# Altium schematic sheet Overview.SchDoc
size 393 x 281 mm; Organization: iMAR GmbH; Address1: Im Reihersbruch 3; Address2: D-66386 St. Ingbert; Address3: www.imar.de; DocumentNumber: 2; SheetNumber: 2; SheetTotal: 7; Abteilung: Entwicklung
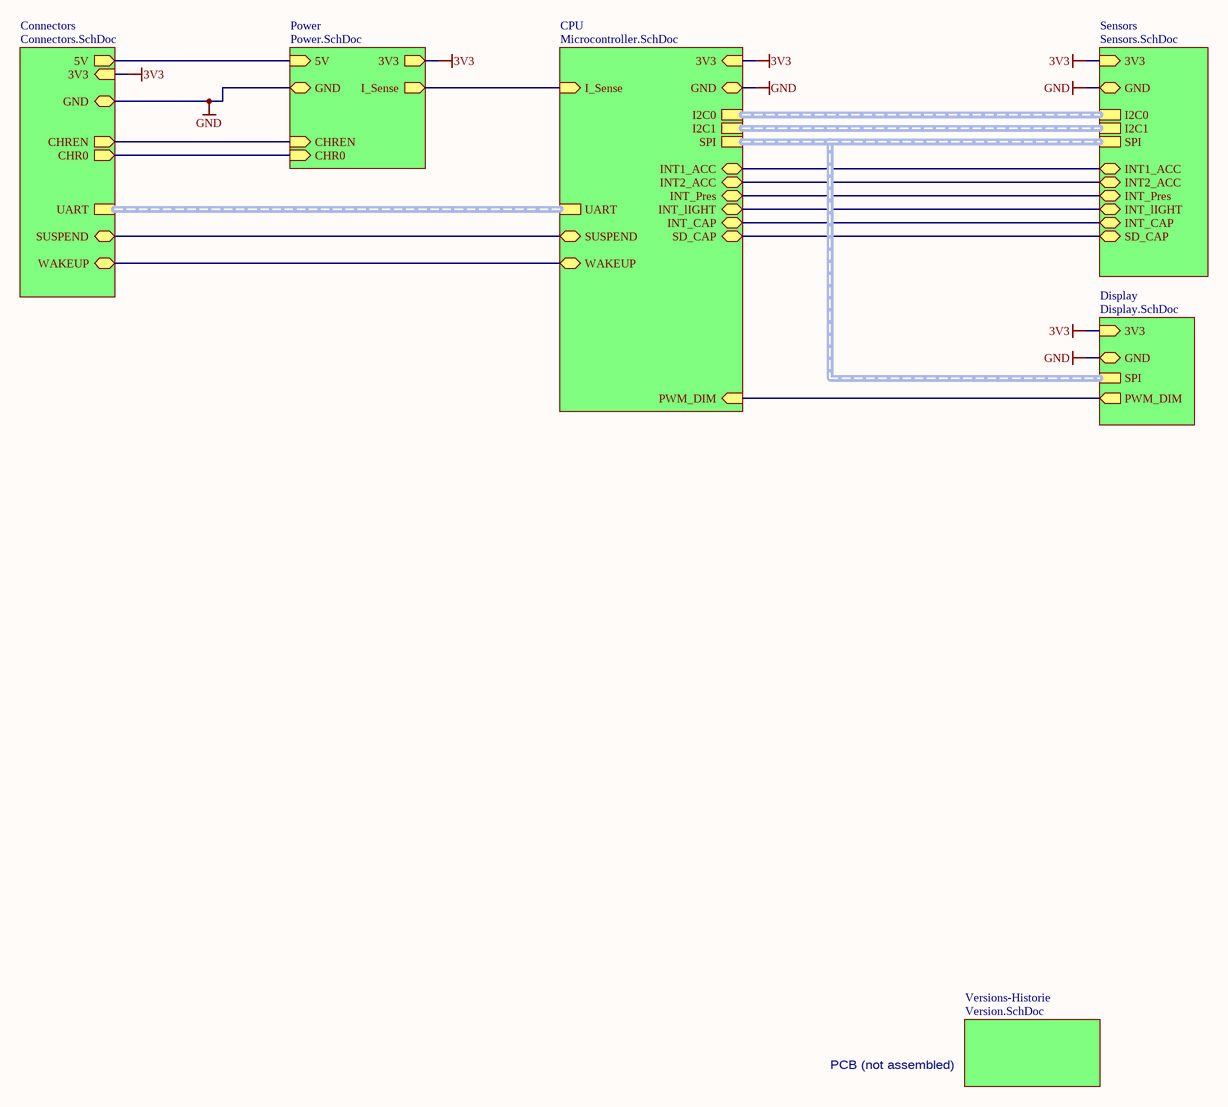
[diagram p0: Overview.SchDoc]

## Parts
PCB_(not_assembled)  PCB (not assembled)  (value not drawn)  (mechanical)

## Sub-sheets
Connectors = Connectors.SchDoc: 5V (out), GND (bidir), UART (harness UART), SUSPEND (bidir), WAKEUP (bidir), 3V3 (in), CHREN (out), CHR0 (out)
CPU = Microcontroller.SchDoc: 3V3 (in), GND (bidir), I2C0 (harness I2C), I2C1 (harness I2C), SPI (harness SPi), UART (harness UART), SUSPEND (bidir), WAKEUP (bidir), INT1_ACC (bidir), INT2_ACC (bidir), INT_Pres (bidir), INT_lIGHT (bidir), INT_CAP (bidir), SD_CAP (bidir), PWM_DIM (in), I_Sense (in)
Display = Display.SchDoc: SPI (harness SPI), 3V3 (in), GND (bidir), PWM_DIM (out)
Power = Power.SchDoc: 5V (in), 3V3 (out), GND (bidir), I_Sense (out), CHREN (in), CHR0 (in)
Sensors = Sensors.SchDoc: I2C0 (harness I2C), I2C1 (harness I2C), SPI (harness SPI), 3V3 (in), GND (bidir), INT1_ACC (bidir), INT2_ACC (bidir), INT_Pres (bidir), INT_lIGHT (bidir), INT_CAP (bidir), SD_CAP (bidir)
Versions-Historie = Version.SchDoc: no entries

## Nets
3V3: sheet CPU/3V3, sheet Display/3V3, sheet Sensors/3V3, sheet Power/3V3, sheet Connectors/3V3
GND: sheet CPU/GND, sheet Display/GND, sheet Sensors/GND, sheet Power/GND, sheet Connectors/GND
(unnamed): sheet CPU/SUSPEND, sheet Connectors/SUSPEND
(unnamed): sheet CPU/WAKEUP, sheet Connectors/WAKEUP
(unnamed): sheet CPU/INT1_ACC, sheet Sensors/INT1_ACC
(unnamed): sheet CPU/INT2_ACC, sheet Sensors/INT2_ACC
(unnamed): sheet CPU/INT_Pres, sheet Sensors/INT_Pres
(unnamed): sheet CPU/INT_lIGHT, sheet Sensors/INT_lIGHT
(unnamed): sheet CPU/INT_CAP, sheet Sensors/INT_CAP
(unnamed): sheet CPU/SD_CAP, sheet Sensors/SD_CAP
(unnamed): sheet CPU/PWM_DIM, sheet Display/PWM_DIM
(unnamed): sheet CPU/I_Sense, sheet Power/I_Sense
(unnamed): sheet Power/5V, sheet Connectors/5V
(unnamed): sheet Power/CHREN, sheet Connectors/CHREN
(unnamed): sheet Power/CHR0, sheet Connectors/CHR0

## Buses and harness runs
harness sheet Connectors/UART = sheet CPU/UART
harness sheet CPU/I2C0 = sheet Sensors/I2C0
harness sheet CPU/I2C1 = sheet Sensors/I2C1
harness sheet CPU/SPI = sheet Display/SPI = sheet Sensors/SPI

## Notes on the sheet
- Date/Datum
- Name
- Identification No./Modell Nr.
- Classification/
- Checked
- Approved
- Issued
- Designation/Benennung
- Revision-Character/Versions-Buchstabe
- Verwendungsbereich
- Drawn/Hersteller
- Dept./Abt.
- iMAR Navigation GmbH
- Rev./Ver.
- Drawing No./Zeichnungsnummer
- Sheet/Blatt
- /
- Im Reihersbruch 3
- D-66386 St. Ingbert
- www.imar.de <http://www.imar.de>
- Filename/Dateiname
- Format
- A3

## Library data of the parts
PCB_(not_assembled) = CMP-ROOT-0069-7: iMAR_Description: =BAUGRUPPE; iMAR_Partnumber: =PN1+'-'+PN2+'-'+PN3+'xx'+PN4